# EAGLE schematic axiom_beta_plugin_module_1xUSB30_v0.2_r1.1.5574ec09 (EAGLE 7.7.0)
Assembly variants: Beta
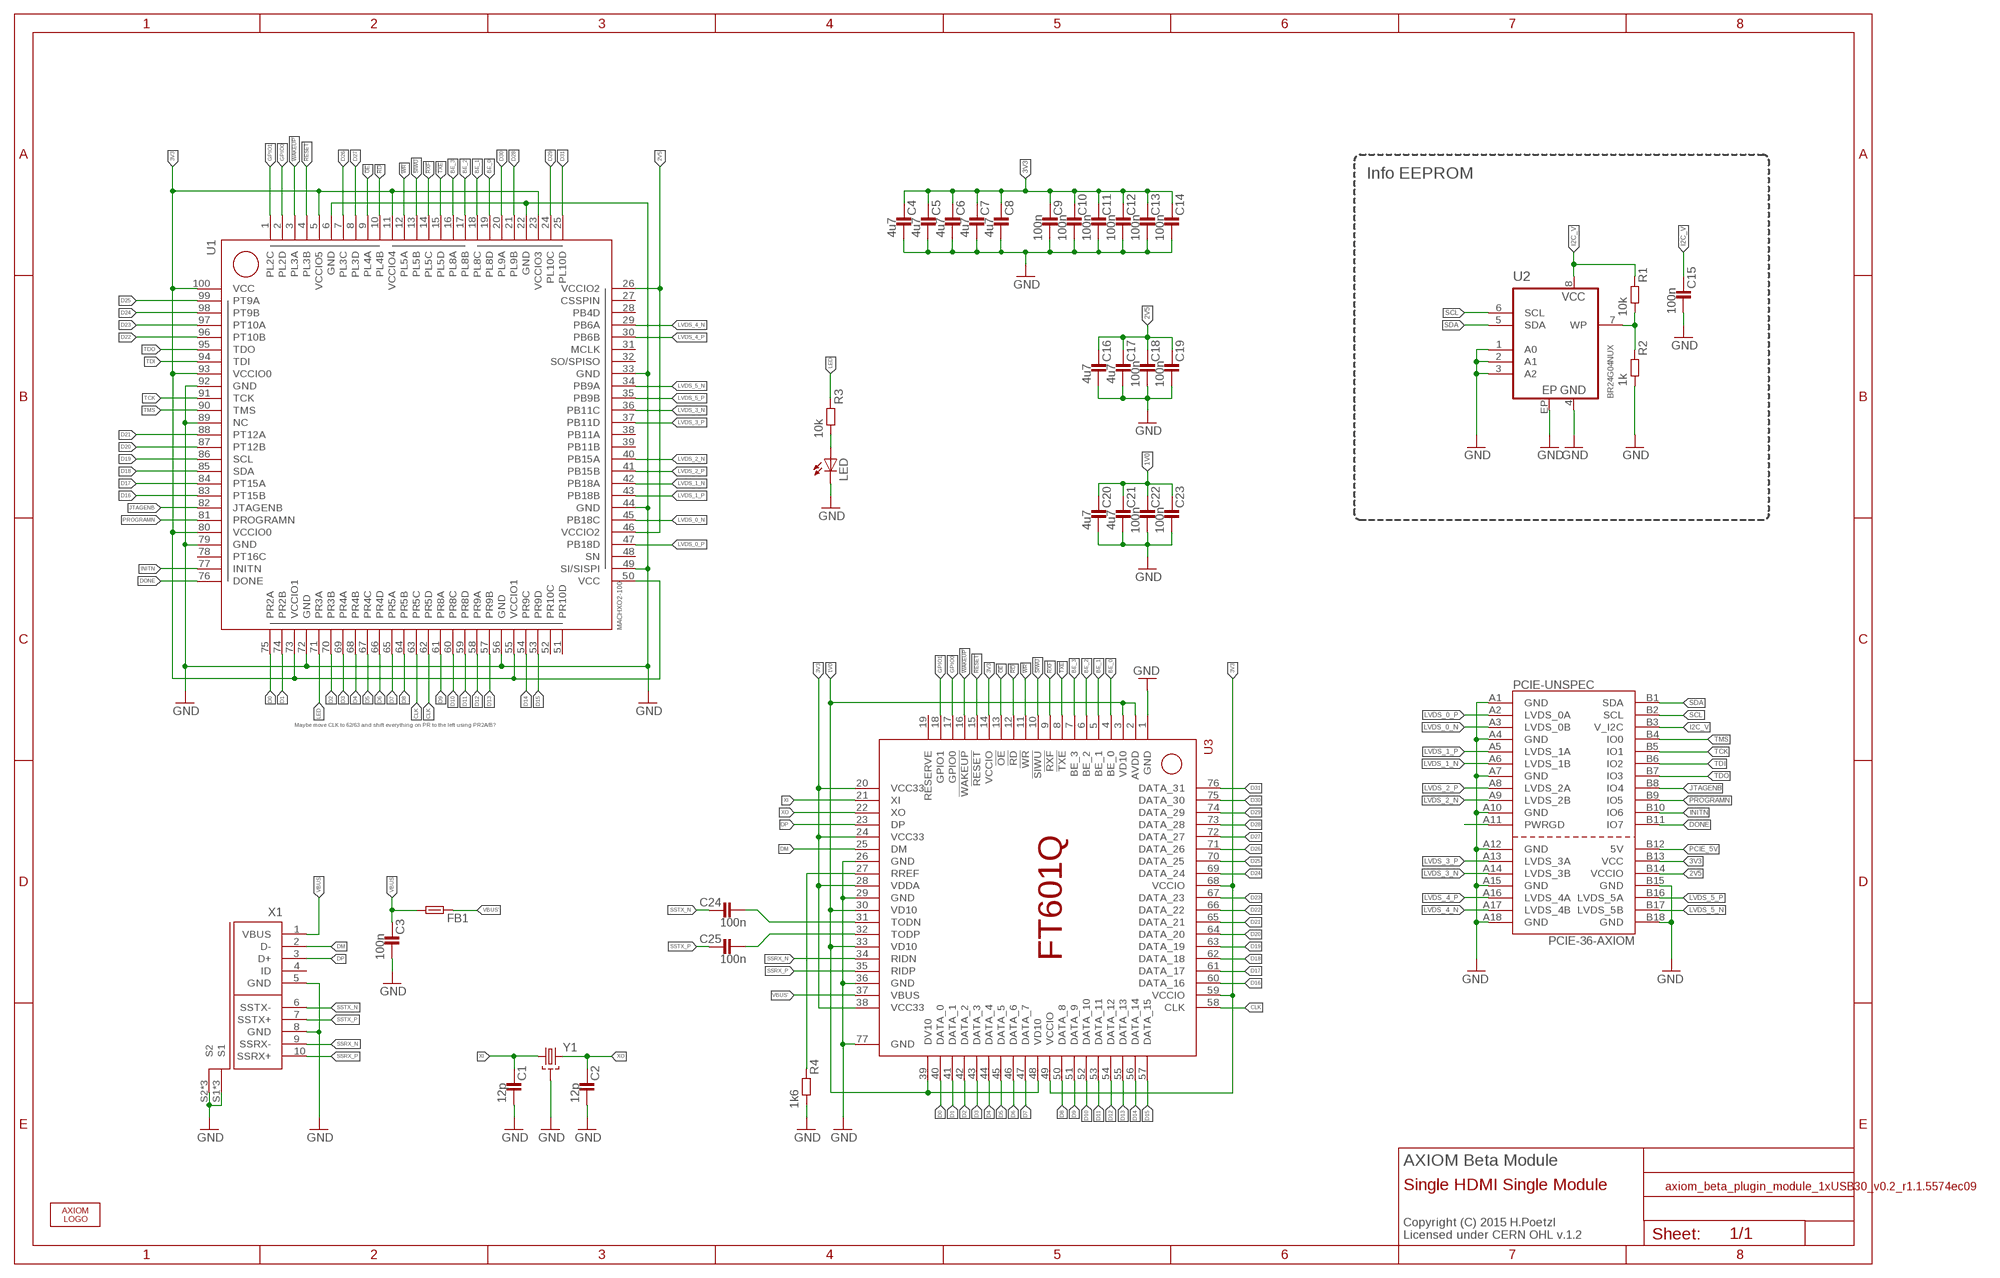
[diagram p0: schematic, sheet 1]

## Parts
C1  12p  C0402-C  [0402-C]
C2  12p  C0402-C  [0402-C]
C3  100n  C0402-C  [0402-C]
C4  4u7  C0402-C  [0402-C]
C5  4u7  C0402-C  [0402-C]
C6  4u7  C0402-C  [0402-C]
C7  4u7  C0402-C  [0402-C]
C8  4u7  C0402-C  [0402-C]
C9  100n  C0402-C  [0402-C]
C10  100n  C0402-C  [0402-C]
C11  100n  C0402-C  [0402-C]
C12  100n  C0402-C  [0402-C]
C13  100n  C0402-C  [0402-C]
C14  100n  C0402-C  [0402-C]
C15  100n  C0402-C  [0402-C]
C16  4u7  C0402-C  [0402-C]
C17  4u7  C0402-C  [0402-C]
C18  100n  C0402-C  [0402-C]
C19  100n  C0402-C  [0402-C]
C20  4u7  C0402-C  [0402-C]
C21  4u7  C0402-C  [0402-C]
C22  100n  C0402-C  [0402-C]
C23  100n  C0402-C  [0402-C]
C24  100n  C0201-C  [0201-C]
C25  100n  C0201-C  [0201-C]
FB1  FB0402-C  [0402-C]
LED  LED  [CHIPLED_0603]
PCIE-UNSPEC  PCIE-36-AXIOM  [PCIE-36-AXIOM]  (not fitted in variant Beta)
R1  10k  R0402-C  [0402-C]
R2  1k  R0402-C  [0402-C]
R3  10k  R0402-B  [0402-B]
R4  1k6  R0201-C  [0201-C]
U1  MACHXO2-100  [MACHXO2-100TQFP]
U2  BR24G04NUX  [DFN200X300X100-9N]
U3  FT601QQFN76  [QFN76]
U$  AXIOM_LOGO328X50  [AXIOM_LOGO_328X50]
X1  10_USB_3.0_2S-SMT  [MICRO-B-30-H-SMT]
Y1  SMD-4P-2G-2.0X1.6  [2.0X1.6]

## Nets
1V0 [power]: C20.1 C21.1 C22.1 C23.1 U3.2(AVDD) U3.3(VD10) U3.30(VD10) U3.33(VD10) U3.39(DV10) U3.48(VD10)
2V5 [power]: C16.1 C17.1 C18.1 C19.1 PCIE-UNSPEC.B14(VCCIO) U1.26(VCCIO2) U1.46(VCCIO2)
3V3 [power]: C4.1 C5.1 C6.1 C7.1 C8.1 C9.1 C10.1 C11.1 C12.1 C13.1 C14.1 PCIE-UNSPEC.B13(VCC) U1.5(VCCIO5) U1.11(VCCIO4) U1.23(VCCIO3) U1.50(VCC) U1.55(VCCIO1) U1.73(VCCIO1) U1.80(VCCIO0) U1.93(VCCIO0) U1.100(VCC) U3.14(VCCIO) U3.20(VCC33) U3.24(VCC33) U3.28(VDDA) U3.38(VCC33) U3.49(VCCIO) U3.59(VCCIO) U3.68(VCCIO)
!OE [parallel]: U1.9(PL4A) U3.13(!OE)
!RD [parallel]: U1.10(PL4B) U3.12(!RD)
!RESET: U1.4(PL3B) U3.15(!RESET)
!RXF [parallel]: U1.14(PL5C) U3.9(!RXF)
!SIWU [parallel]: U1.13(PL5B) U3.10(!SIWU)
!TXE [parallel]: U1.15(PL5D) U3.8(!TXE)
!WAKEUP: U1.3(PL3A) U3.16(!WAKEUP)
!WR [parallel]: U1.12(PL5A) U3.11(!WR)
BE_0 [parallel]: U1.19(PL8D) U3.4(BE_0)
BE_1 [parallel]: U1.18(PL8C) U3.5(BE_1)
BE_2 [parallel]: U1.17(PL8B) U3.6(BE_2)
BE_3 [parallel]: U1.16(PL8A) U3.7(BE_3)
CLK [parallel]: U1.62(PR5D) U1.63(PR5C) U3.58(CLK)
D0 [parallel]: U1.75(PR2A) U3.40(DATA_0)
D1 [parallel]: U1.74(PR2B) U3.41(DATA_1)
D2 [parallel]: U1.70(PR3B) U3.42(DATA_2)
D3 [parallel]: U1.69(PR4A) U3.43(DATA_3)
D4 [parallel]: U1.68(PR4B) U3.44(DATA_4)
D5 [parallel]: U1.67(PR4C) U3.45(DATA_5)
D6 [parallel]: U1.66(PR4D) U3.46(DATA_6)
D7 [parallel]: U1.65(PR5A) U3.47(DATA_7)
D8 [parallel]: U1.64(PR5B) U3.50(DATA_8)
D9 [parallel]: U1.61(PR8A) U3.51(DATA_9)
D10 [parallel]: U1.60(PR8C) U3.52(DATA_10)
D11 [parallel]: U1.59(PR8D) U3.53(DATA_11)
D12 [parallel]: U1.58(PR9A) U3.54(DATA_12)
D13 [parallel]: U1.57(PR9B) U3.55(DATA_13)
D14 [parallel]: U1.54(PR9C) U3.56(DATA_14)
D15 [parallel]: U1.53(PR9D) U3.57(DATA_15)
D16 [parallel]: U1.83(PT15B) U3.60(DATA_16)
D17 [parallel]: U1.84(PT15A) U3.61(DATA_17)
D18 [parallel]: U1.85(SDA) U3.62(DATA_18)
D19 [parallel]: U1.86(SCL) U3.63(DATA_19)
D20 [parallel]: U1.87(PT12B) U3.64(DATA_20)
D21 [parallel]: U1.88(PT12A) U3.65(DATA_21)
D22 [parallel]: U1.96(PT10B) U3.66(DATA_22)
D23 [parallel]: U1.97(PT10A) U3.67(DATA_23)
D24 [parallel]: U1.98(PT9B) U3.69(DATA_24)
D25 [parallel]: U1.99(PT9A) U3.70(DATA_25)
D26 [parallel]: U1.7(PL3C) U3.71(DATA_26)
D27 [parallel]: U1.8(PL3D) U3.72(DATA_27)
D28 [parallel]: U1.21(PL9B) U3.73(DATA_28)
D29 [parallel]: U1.24(PL10C) U3.74(DATA_29)
D30 [parallel]: U1.20(PL9A) U3.75(DATA_30)
D31 [parallel]: U1.25(PL10D) U3.76(DATA_31)
DM: U3.25(DM) X1.2(D-)
DONE: PCIE-UNSPEC.B11(IO7) U1.76(DONE)
DP: U3.23(DP) X1.3(D+)
GND: C1.2 C2.2 C3.2 C4.2 C5.2 C6.2 C7.2 C8.2 C9.2 C10.2 C11.2 C12.2 C13.2 C14.2 C15.2 C16.2 C17.2 C18.2 C19.2 C20.2 C21.2 C22.2 C23.2 LED.C PCIE-UNSPEC.A1(GND) PCIE-UNSPEC.A4(GND) PCIE-UNSPEC.A7(GND) PCIE-UNSPEC.A10(GND) PCIE-UNSPEC.A12(GND) PCIE-UNSPEC.A15(GND) PCIE-UNSPEC.A18(GND) PCIE-UNSPEC.B15(GND) PCIE-UNSPEC.B18(GND) R2.2 R4.2 U1.6(GND) U1.22(GND) U1.33(GND) U1.44(GND) U1.49(SI/SISPI) U1.56(GND) U1.72(GND) U1.79(GND) U1.89(NC) U1.92(GND) U2.1(A0) U2.2(A1) U2.3(A2) U2.4(GND) U2.EP U3.1(GND) U3.26(GND) U3.29(GND) U3.36(GND) U3.77(GND) X1.5(GND) X1.8(GND) X1.S1 X1.S2 X1.Z1(S1) X1.Z2(S1) X1.Z3(S2) X1.Z4(S2) Y1.2(GND) Y1.4(GND)
GPIO0: U1.2(PL2D) U3.17(GPIO0)
GPIO1: U1.1(PL2C) U3.18(GPIO1)
I2C_V: C15.1 PCIE-UNSPEC.B3(V_I2C) R1.1 U2.8(VCC)
INITN: PCIE-UNSPEC.B10(IO6) U1.77(INITN)
JTAGENB: PCIE-UNSPEC.B8(IO4) U1.82(JTAGENB)
LED: R3.1 U1.71(PR3A)
LVDS_0_N [LVDS]: PCIE-UNSPEC.A3(LVDS_0B) U1.45(PB18C)
LVDS_0_P [LVDS]: PCIE-UNSPEC.A2(LVDS_0A) U1.47(PB18D)
LVDS_1_N [LVDS]: PCIE-UNSPEC.A6(LVDS_1B) U1.42(PB18A)
LVDS_1_P [LVDS]: PCIE-UNSPEC.A5(LVDS_1A) U1.43(PB18B)
LVDS_2_N [LVDS]: PCIE-UNSPEC.A9(LVDS_2B) U1.40(PB15A)
LVDS_2_P [LVDS]: PCIE-UNSPEC.A8(LVDS_2A) U1.41(PB15B)
LVDS_3_N [LVDS]: PCIE-UNSPEC.A14(LVDS_3B) U1.36(PB11C)
LVDS_3_P [LVDS]: PCIE-UNSPEC.A13(LVDS_3A) U1.37(PB11D)
LVDS_4_N [LVDS]: PCIE-UNSPEC.A17(LVDS_4B) U1.29(PB6A)
LVDS_4_P [LVDS]: PCIE-UNSPEC.A16(LVDS_4A) U1.30(PB6B)
LVDS_5_N [LVDS]: PCIE-UNSPEC.B17(LVDS_5B) U1.34(PB9A)
LVDS_5_P [LVDS]: PCIE-UNSPEC.B16(LVDS_5A) U1.35(PB9B)
N$1: LED.A R3.2
N$2: R4.1 U3.27(RREF)
N$12: R1.2 R2.1 U2.7(WP)
N$209: PCIE-UNSPEC.A11(PWRGD)
PCIE_5V: PCIE-UNSPEC.B12(5V)
PROGRAMN: PCIE-UNSPEC.B9(IO5) U1.81(PROGRAMN)
SCL: PCIE-UNSPEC.B2(SCL) U2.6(SCL)
SDA: PCIE-UNSPEC.B1(SDA) U2.5(SDA)
SSRX_N [MGT]: U3.34(RIDN) X1.9(SSRX-)
SSRX_P [MGT]: U3.35(RIDP) X1.10(SSRX+)
SSTX_N [MGT]: C24.1 X1.6(SSTX-)
SSTX_P [MGT]: C25.1 X1.7(SSTX+)
TCK: PCIE-UNSPEC.B5(IO1) U1.91(TCK)
TDI: PCIE-UNSPEC.B6(IO2) U1.94(TDI)
TDO: PCIE-UNSPEC.B7(IO3) U1.95(TDO)
TMS: PCIE-UNSPEC.B4(IO0) U1.90(TMS)
TOD_N [MGT]: C24.2 U3.31(TODN)
TOD_P [MGT]: C25.2 U3.32(TODP)
VBUS [power]: C3.1 FB1.2 X1.1(VBUS)
VBUS' [power]: FB1.1 U3.37(VBUS)
XI: C1.1 U3.21(XI) Y1.1
XO: C2.1 U3.22(XO) Y1.3
Unconnected: U1.27(CSSPIN) U1.28(PB4D) U1.31(MCLK) U1.32(SO/SPISO) U1.38(PB11A) U1.39(PB11B) U1.48(SN) U1.51(PR10D) U1.52(PR10C) U1.78(PT16C) U3.19(RESERVE) X1.4(ID)

## Notes on the sheet
- Info EEPROM
- Maybe move CLK to 62/63 and shift everything on PR to the left using PR2A/B?
- AXIOM Beta Module
- Single HDMI Single Module
- Copyright (C) 2015 H.Poetzl
  Licensed under CERN OHL v.1.2

## Library data of the parts
C1-C25 = generic-rcl:C
FB1 = generic-rcl:FB
LED = led:LED
PCIE-UNSPEC = PCIe:PCIE-36-AXIOM
R1-R4 = generic-rcl:R
U1 = machxo2:MACHXO2-100: Lattice MachXO2 ultra low power, instant-on, non-volatile PLD.
U2 = eeprom:BR24G04
U3 = ft601q:FT601Q
U$ = logos_apertus_axiom:AXIOM_LOGO
X1 = usb:10_USB_3.0_2S
Y1 = xtal:SMD-4P-2G

## Net classes
0 default: width 0.127 mm, drill 0.203 mm, clearance 0.127 mm
1 power: width 0.203 mm, drill 0.254 mm, clearance 0.152 mm
2 LVDS: width 0.152 mm, drill 0.203 mm, clearance 0.152 mm
3 MGT: width 0.127 mm, drill 0.203 mm, clearance 0.127 mm
4 parallel: width 0.127 mm, drill 0.203 mm, clearance 0.127 mm